# Altium schematic sheet PID.SchDoc
size A; SheetNumber: 3; SheetTotal: 6
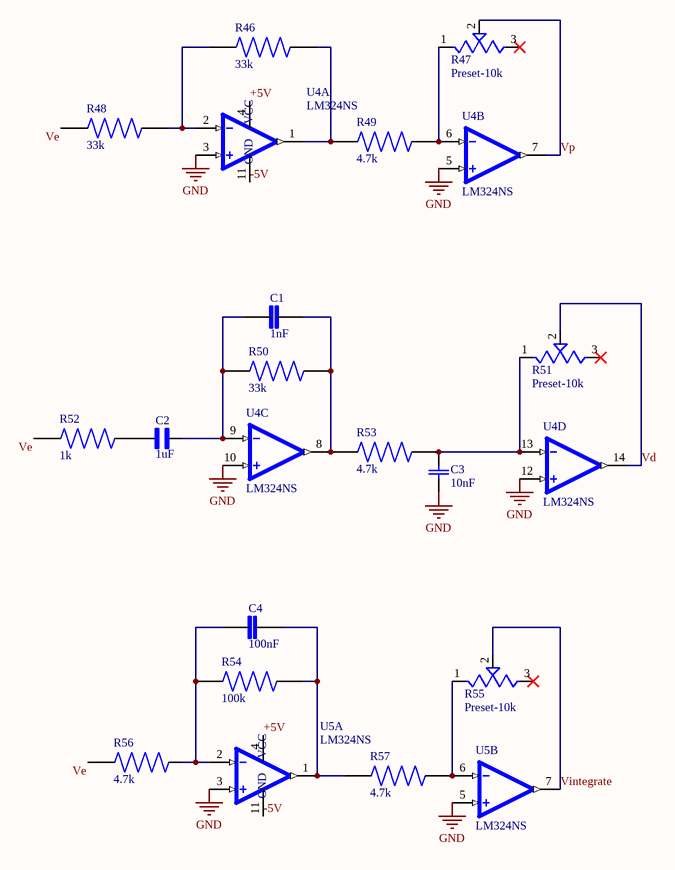
[diagram p0: PID.SchDoc]

## Parts
C1  1nF  [CAPC2012X70]
C2  1uF  [CAPC2012X135N]
C3  10nF  [CAPC2013X110N]
C4  100nF  [CAPC2012X70]
R46  33k  [RESC2012X60N]
R47  Preset-10k  [TRIM_3306F-1-103]
R48  33k  [RESC2012X60N]
R49  4.7k  [RESC2012X60N]
R50  33k  [RESC2012X60N]
R51  Preset-10k  [TRIM_3306F-1-103]
R52  1k  [RESC2012X60N]
R53  4.7k  [RESC2012X60N]
R54  100k  [RESC2012X60N]
R55  Preset-10k  [TRIM_3306F-1-103]
R56  4.7k  [RESC2012X60N]
R57  4.7k  [RESC2012X60N]
U4  LM324NS  [SOIC127P780X200-14N]  (parts A,B,C,D of 4)
U5  LM324NS  [SOIC127P780X200-14N]  (parts A,B of 4)

## Nets
GND: C3.1(C1) U4.3(1IN+) U4.5(2IN+) U4.10(3IN+) U4.12(4IN+) U5.3(1IN+) U5.5(2IN+)
+5V: U4.4(VCC) U5.4(VCC)
-5V: U4.11(GND) U5.11(GND)
Vd: R51.2(W) U4.14(4OUT)
Ve: R48.1 R52.1 R56.1
Vintegrate: R55.2(W) U5.7(2OUT)
Vp: R47.2(W) U4.7(2OUT)
NetC1_1: C1.1 C2.1 R50.1 U4.9(3IN-)
NetC1_2: C1.2 R50.2 R53.1 U4.8(3OUT)
NetC2_2: C2.2 R52.2
NetC3_2: C3.2(C2) R51.1(CCW) R53.2 U4.13(4IN-)
NetC4_1: C4.1 R54.1 R56.2 U5.2(1IN-)
NetC4_2: C4.2 R54.2 R57.1 U5.1(1OUT)
NetR46_1: R46.1 R48.2 U4.2(1IN-)
NetR46_2: R46.2 R49.1 U4.1(1OUT)
NetR47_1: R47.1(CCW) R49.2 U4.6(2IN-)
NetR55_1: R55.1(CCW) R57.2 U5.6(2IN-)

Not connected (* = marked no-connect by the designer): R47 3(CW)*; R51 3(CW)*; R55 3(CW)*

## Library data of the parts
C1 C4 = 1nF: 1000 pF Â±10% 50V Ceramic Capacitor X7R 0805 (2012 Metric); CC0805KRX7R9BB102; MF: Yageo; SnapEDA_Link: https://www.snapeda.com/parts/CC0805KRX7R9BB102/Yageo/view-part/?ref=snap; Package: 0805 Yageo; Value: *; MP: CC0805KRX7R9BB102; Check_prices: https://www.snapeda.com/parts/CC0805KRX7R9BB102/Yageo/view-part/?ref=eda
C2 = 1uF: SMD Capacitor X7R(EIA) with Capacitance: 1.0uF Tol. 10%. Rated Voltage: 25Vdc; GRM21BR71E105KA99L; MF: Murata; SnapEDA_Link: https://www.snapeda.com/parts/GRM21BR71E105KA99L/Murata/view-part/?ref=snap; Package: 2012 Murata; Value: *; MP: GRM21BR71E105KA99L; Check_prices: https://www.snapeda.com/parts/GRM21BR71E105KA99L/Murata/view-part/?ref=eda
C3 = 10nF: 10000 pF Â±10% 50V Ceramic Capacitor X7R 0805 (2012 Metric); CC0805KRX7R9BB103; MF: Yageo; SnapEDA_Link: https://www.snapeda.com/parts/CC0805KRX7R9BB103/Yageo/view-part/?ref=snap; Package: 0805 Yageo; Value: *; MP: CC0805KRX7R9BB103; Check_prices: https://www.snapeda.com/parts/CC0805KRX7R9BB103/Yageo/view-part/?ref=eda
R46 R48 R50 = 33k: 33 kOhms Â±1% 0.125W, 1/8W Chip Resistor 0805 (2012 Metric) Moisture Resistant Thick Film; RC0805FR-0733KL; MF: Yageo; SnapEDA_Link: https://www.snapeda.com/parts/RC0805FR-0733KL/Yageo/view-part/?ref=snap; Package: 2012 Yageo; Value: *; MP: RC0805FR-0733KL; Check_prices: https://www.snapeda.com/parts/RC0805FR-0733KL/Yageo/view-part/?ref=eda
R47 R51 R55 = Preset: TRIMMER - 6MM ROUND, SINGLE-TURN,CERMET, 10K OHMS | Bourns 3306F-1-103; SnapEDA_Link: https://www.snapeda.com/parts/3306F-1-103/Bourns/view-part/?ref=snap; Package: 3306F Bourns; Value: *; MF: Bourns; MP: 3306F-1-103; Check_prices: https://www.snapeda.com/parts/3306F-1-103/Bourns/view-part/?ref=eda
R49 R53 R56 R57 = 4.7k: 4.7 kOhms Â±1% 0.125W, 1/8W Chip Resistor 0805 (2012 Metric) Moisture Resistant Thick Film; RC0805FR-074K7L; MF: Yageo; Check_prices: https://www.snapeda.com/parts/RC0805FR-074K7L/Yageo/view-part/?ref=eda; Value: *; Availability: In Stock; MP: RC0805FR-074K7L; Price: None; Package: 2012 Rohm Semiconductor; SnapEDA_Link: https://www.snapeda.com/parts/RC0805FR-074K7L/Yageo/view-part/?ref=snap; Purchase-URL: https://pricing.snapeda.com/search/part/RC0805FR-074K7L/?ref=eda
R52 = 1k: 1 kOhms Â±1% 0.125W, 1/8W Chip Resistor 0805 (2012 Metric) Moisture Resistant Thick Film; RC0805FR-071KL; MF: Yageo; DigiKey_Part_Number: 311-1.00KCRTR-ND; Purchase-URL: https://pricing.snapeda.com/search?q=RC0805FR-071KL&ref=eda; Package: 2012 Yageo; Check_prices: https://www.snapeda.com/parts/RC0805FR-071KL/Yageo/view-part/?ref=eda; Value: *; SnapEDA_Link: https://www.snapeda.com/parts/RC0805FR-071KL/Yageo/view-part/?ref=snap; MP: RC0805FR-071KL
R54 = 100k: 100 kOhms Â±1% 0.125W, 1/8W Chip Resistor 0805 (2012 Metric) Moisture Resistant Thick Film; RC0805FR-07100KL; MF: Yageo; SnapEDA_Link: https://www.snapeda.com/parts/RC0805FR-07100KL/Yageo/view-part/?ref=snap; Package: 2012 Yageo; Value: *; MP: RC0805FR-07100KL; Check_prices: https://www.snapeda.com/parts/RC0805FR-07100KL/Yageo/view-part/?ref=eda
U4 U5 = LM324NS: 4-Channel industry standard operational amplifier 14-SO 0 to 70; LM324NSRG4; MF: Texas Instruments; Purchase-URL: https://pricing.snapeda.com/search/part/LM324NSRG4/?ref=eda; MP: LM324NSRG4; SnapEDA_Link: https://www.snapeda.com/parts/LM324NSRG4/Texas+Instruments/view-part/?ref=snap; Value: *; Package: SOP-14 Texas Instruments; Price: None; Availability: In Stock; Check_prices: https://www.snapeda.com/parts/LM324NSRG4/Texas+Instruments/view-part/?ref=eda